# Altium project Thrust Stand Board.PrjPcb
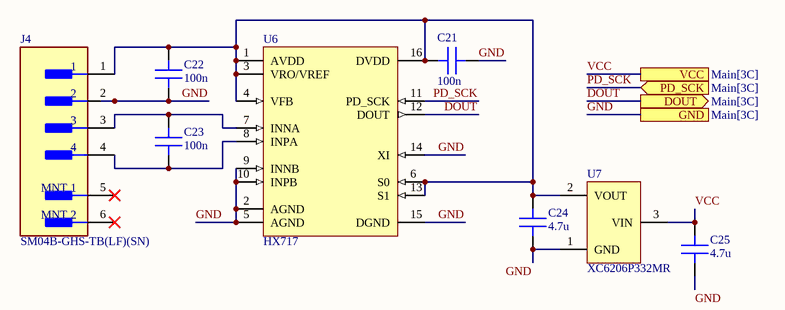
[diagram p0: Load Cell Amp.SchDoc]
1 sheet, 8 parts. Net scope: flat (ports and power ports of the same name join across sheets).
Board files: Thrust Stand Board.PcbDoc, Panel.PcbDoc

## Sheet Load Cell Amp.SchDoc
size A4

### Parts
C21  100n  [IPC C C0402 NO SILK]
C22  100n  [IPC C C0402 NO SILK]
C23  100n  [IPC C C0402 NO SILK]
C24  4.7u  [IPC C C0603 NO SILK]
C25  4.7u  [IPC C C0603 NO SILK]
J4  SM04B-GHS-TB(LF)(SN)  [FP-SM04B-GHS-TB_LF_SN-MFG]
U6  HX717  [SOIC127P600X160-16L]
U7  XC6206P332MR  [SOT23-3]

### Ports
DOUT (out, see Main[3C]), GND (see Main[3C]), PD_SCK (in, see Main[3C]), VCC (see Main[3C])

### Nets
DOUT: U6.12(DOUT) ; port DOUT
GND: C21.1 C22.1 C24.1 C25.1 J4.2 U6.2(AGND) U6.5(AGND) U6.9(INNB) U6.10(INPB) U6.14(XI) U6.15(DGND) U7.1(GND) ; port GND
PD_SCK: U6.11(PD_SCK) ; port PD_SCK
VCC: C25.2 U7.3(VIN) ; port VCC
NetC21_2: C21.2 C22.2 C24.2 J4.1 U6.1(AVDD) U6.3(VRO/VREF) U6.4(VFB) U6.6(S0) U6.13(S1) U6.16(DVDD) U7.2(VOUT)
NetC23_1: C23.1 J4.4 U6.8(INPA)
NetC23_2: C23.2 J4.3 U6.7(INNA)

Not connected (* = marked no-connect by the designer): J4 5(MNT_1)* 6(MNT_2)*

### Library data of the parts
C21-C23 = Generic CAP 0402: Value: 100n
C24 C25 = Generic CAP 0603: Value: 4.7u
J4 = CMP-17439-000411-1: CONN HEADER SMD R/A 4POS 1.25MM; Voltage Rating: 50V; Number of Contacts: 4; Current Rating: 1A; Termination: Solder; Mount: Surface Mount; REACH SVHC: No SVHC; Packaging: Cut Tape; Contact Material: Bronze; Series: GH; Orientation: Right Angle; Lead Free: Lead Free; Housing Material: Nylon; Contact Plating: Tin; Housing Color: Natural; Number of Rows: 1; Pitch: 1.25mm; Number of Positions: 4
U7 = 3.3V Regulator XC6206P332MR_C5446: Output Type: Output Polarity:Positive Number of Outputs:1 Maximum Input Voltage:6V Output Voltage:3.3V~3.3V Output Voltage:3.3V~3.3V Dropout Voltage:680mV@(100mA) Output Current:200mA Power Supply Rejection Ratio (PSRR):-; Manufacturer: TOREX(特瑞仕); Add into BOM: yes; Number of Outputs: 1; Maximum Input Voltage: 6V; Output Current: 200mA; Symbol: XC6206P332MR; Device: XC6206P332MR_C5446; LCSC Part Name: 正 Vin=6V Vout=3.3V 200mA; Supplier Part: C5446; Manufacturer Part: XC6206P332MR; Supplier Footprint: SOT-23-3L; JLCPCB Part Class: Basic Part; Datasheet: https://atta.szlcsc.com/upload/public/pdf/source/20130801/1457706628791.pdf; Supplier: LCSC; Convert to PCB: yes; Output Polarity: Positive; Output Voltage: 3.3V~3.3V; Dropout Voltage: 680mV@(100mA); Power Supply Rejection Ratio (PSRR): -